# Altium project AudioDSP-1.0.PrjPcb
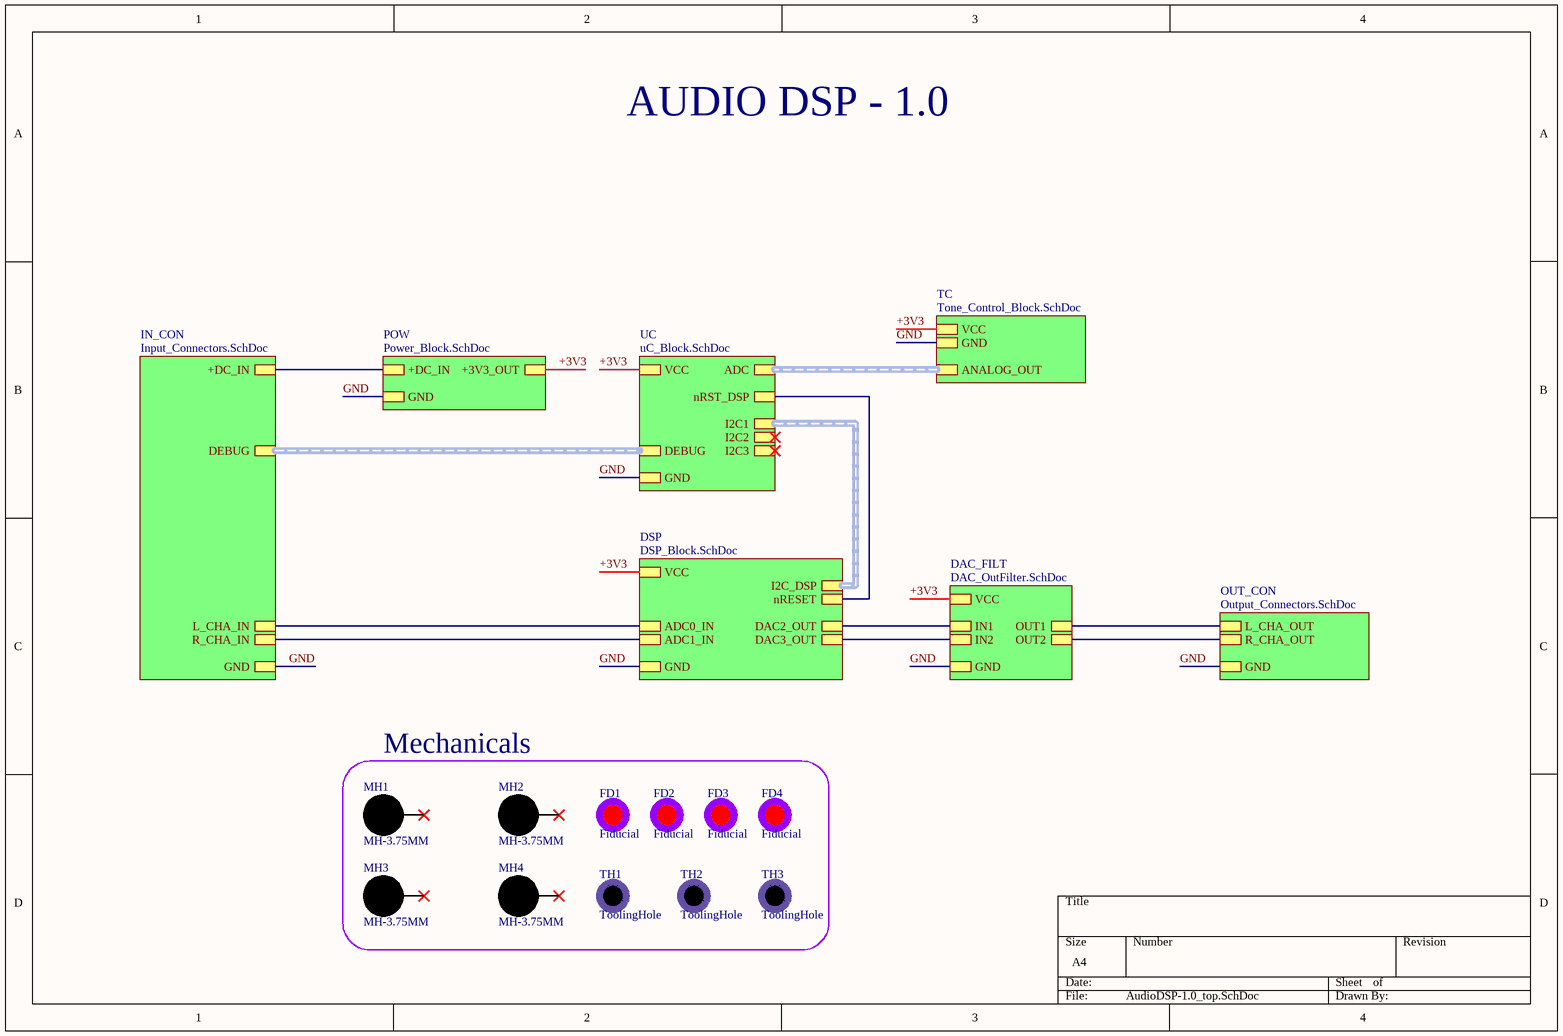
[diagram p0: AudioDSP-1.0_top.SchDoc]
8 sheets, 124 parts. Net scope: hierarchical (ports join the sheet entries above them; power ports are global).
Board file: AudioDSP-1.0.PcbDoc
Sheets:
  AudioDSP-1.0_top.SchDoc
    DSP = DSP_Block.SchDoc
    DAC_FILT = DAC_OutFilter.SchDoc
    IN_CON = Input_Connectors.SchDoc
    POW = Power_Block.SchDoc
    UC = uC_Block.SchDoc
    OUT_CON = Output_Connectors.SchDoc
    TC = Tone_Control_Block.SchDoc

## Sheet AudioDSP-1.0_top.SchDoc
size A4; SheetNumber: 1; SheetTotal: 8

### Parts
FD1  Fiducial  [Fiducial]  (no BOM)
FD2  Fiducial  [Fiducial]  (no BOM)
FD3  Fiducial  [Fiducial]  (no BOM)
FD4  Fiducial  [Fiducial]  (no BOM)
MH1  MH-3.75MM  [MH-3.75mm-NP]  (no BOM)
MH2  MH-3.75MM  [MH-3.75mm-NP]  (no BOM)
MH3  MH-3.75MM  [MH-3.75mm-NP]  (no BOM)
MH4  MH-3.75MM  [MH-3.75mm-NP]  (no BOM)
TH1  ToolingHole  [TOOLING-HOLE]  (no BOM)
TH2  ToolingHole  [TOOLING-HOLE]  (no BOM)
TH3  ToolingHole  [TOOLING-HOLE]  (no BOM)

### Blocks framed on the sheet
Mechanicals: FD1-FD4 MH1-MH4 TH1-TH3

### Sub-sheets
DAC_FILT = DAC_OutFilter.SchDoc: VCC, GND, IN1, IN2, OUT1, OUT2
DSP = DSP_Block.SchDoc: VCC, GND, I2C_DSP (harness I2C_BUS), nRESET, DAC2_OUT, DAC3_OUT, ADC0_IN, ADC1_IN
IN_CON = Input_Connectors.SchDoc: +DC_IN, GND, R_CHA_IN, L_CHA_IN, DEBUG (harness SERIAL_WIRE)
OUT_CON = Output_Connectors.SchDoc: R_CHA_OUT, L_CHA_OUT, GND
POW = Power_Block.SchDoc: +DC_IN, +3V3_OUT, GND
TC = Tone_Control_Block.SchDoc: VCC, GND, ANALOG_OUT (harness ADC_BUS)
UC = uC_Block.SchDoc: VCC, GND, DEBUG (harness SERIAL_WIRE), I2C1 (harness I2C_BUS), I2C2 (harness I2C_BUS), I2C3 (harness I2C_BUS), ADC (harness ADC_BUS), nRST_DSP

### Nets
+3V3: sheet DSP/VCC, sheet DAC_FILT/VCC, sheet POW/+3V3_OUT, sheet UC/VCC, sheet TC/VCC
+DC_IN: sheet IN_CON/+DC_IN, sheet POW/+DC_IN
ADC0_IN: sheet DSP/ADC0_IN, sheet IN_CON/L_CHA_IN
ADC1_IN: sheet DSP/ADC1_IN, sheet IN_CON/R_CHA_IN
DAC2_OUT: sheet DSP/DAC2_OUT, sheet DAC_FILT/IN1
DAC3_OUT: sheet DSP/DAC3_OUT, sheet DAC_FILT/IN2
GND: sheet DSP/GND, sheet DAC_FILT/GND, sheet IN_CON/GND, sheet POW/GND, sheet UC/GND, sheet OUT_CON/GND, sheet TC/GND
nRESET: sheet DSP/nRESET, sheet UC/nRST_DSP
OUT1: sheet DAC_FILT/OUT1, sheet OUT_CON/L_CHA_OUT
OUT2: sheet DAC_FILT/OUT2, sheet OUT_CON/R_CHA_OUT

Not connected (* = marked no-connect by the designer): MH1 1*; MH2 1*; MH3 1*; MH4 1*

### Buses and harness runs
harness sheet DSP/I2C_DSP = sheet UC/I2C1
harness sheet IN_CON/DEBUG = sheet UC/DEBUG
harness sheet TC/ANALOG_OUT = sheet UC/ADC

### Notes on the sheet
- AUDIO DSP - 1.0

### Library data of the parts
FD1-FD4 = Fiducial: ClassName: Fiducials
MH1-MH4 = MH-3.75MM: ClassName: MountHole
TH1-TH3 = ToolingHole: ClassName: Tooling

## Sheet DSP_Block.SchDoc
size A3; SheetNumber: 4; SheetTotal: 8
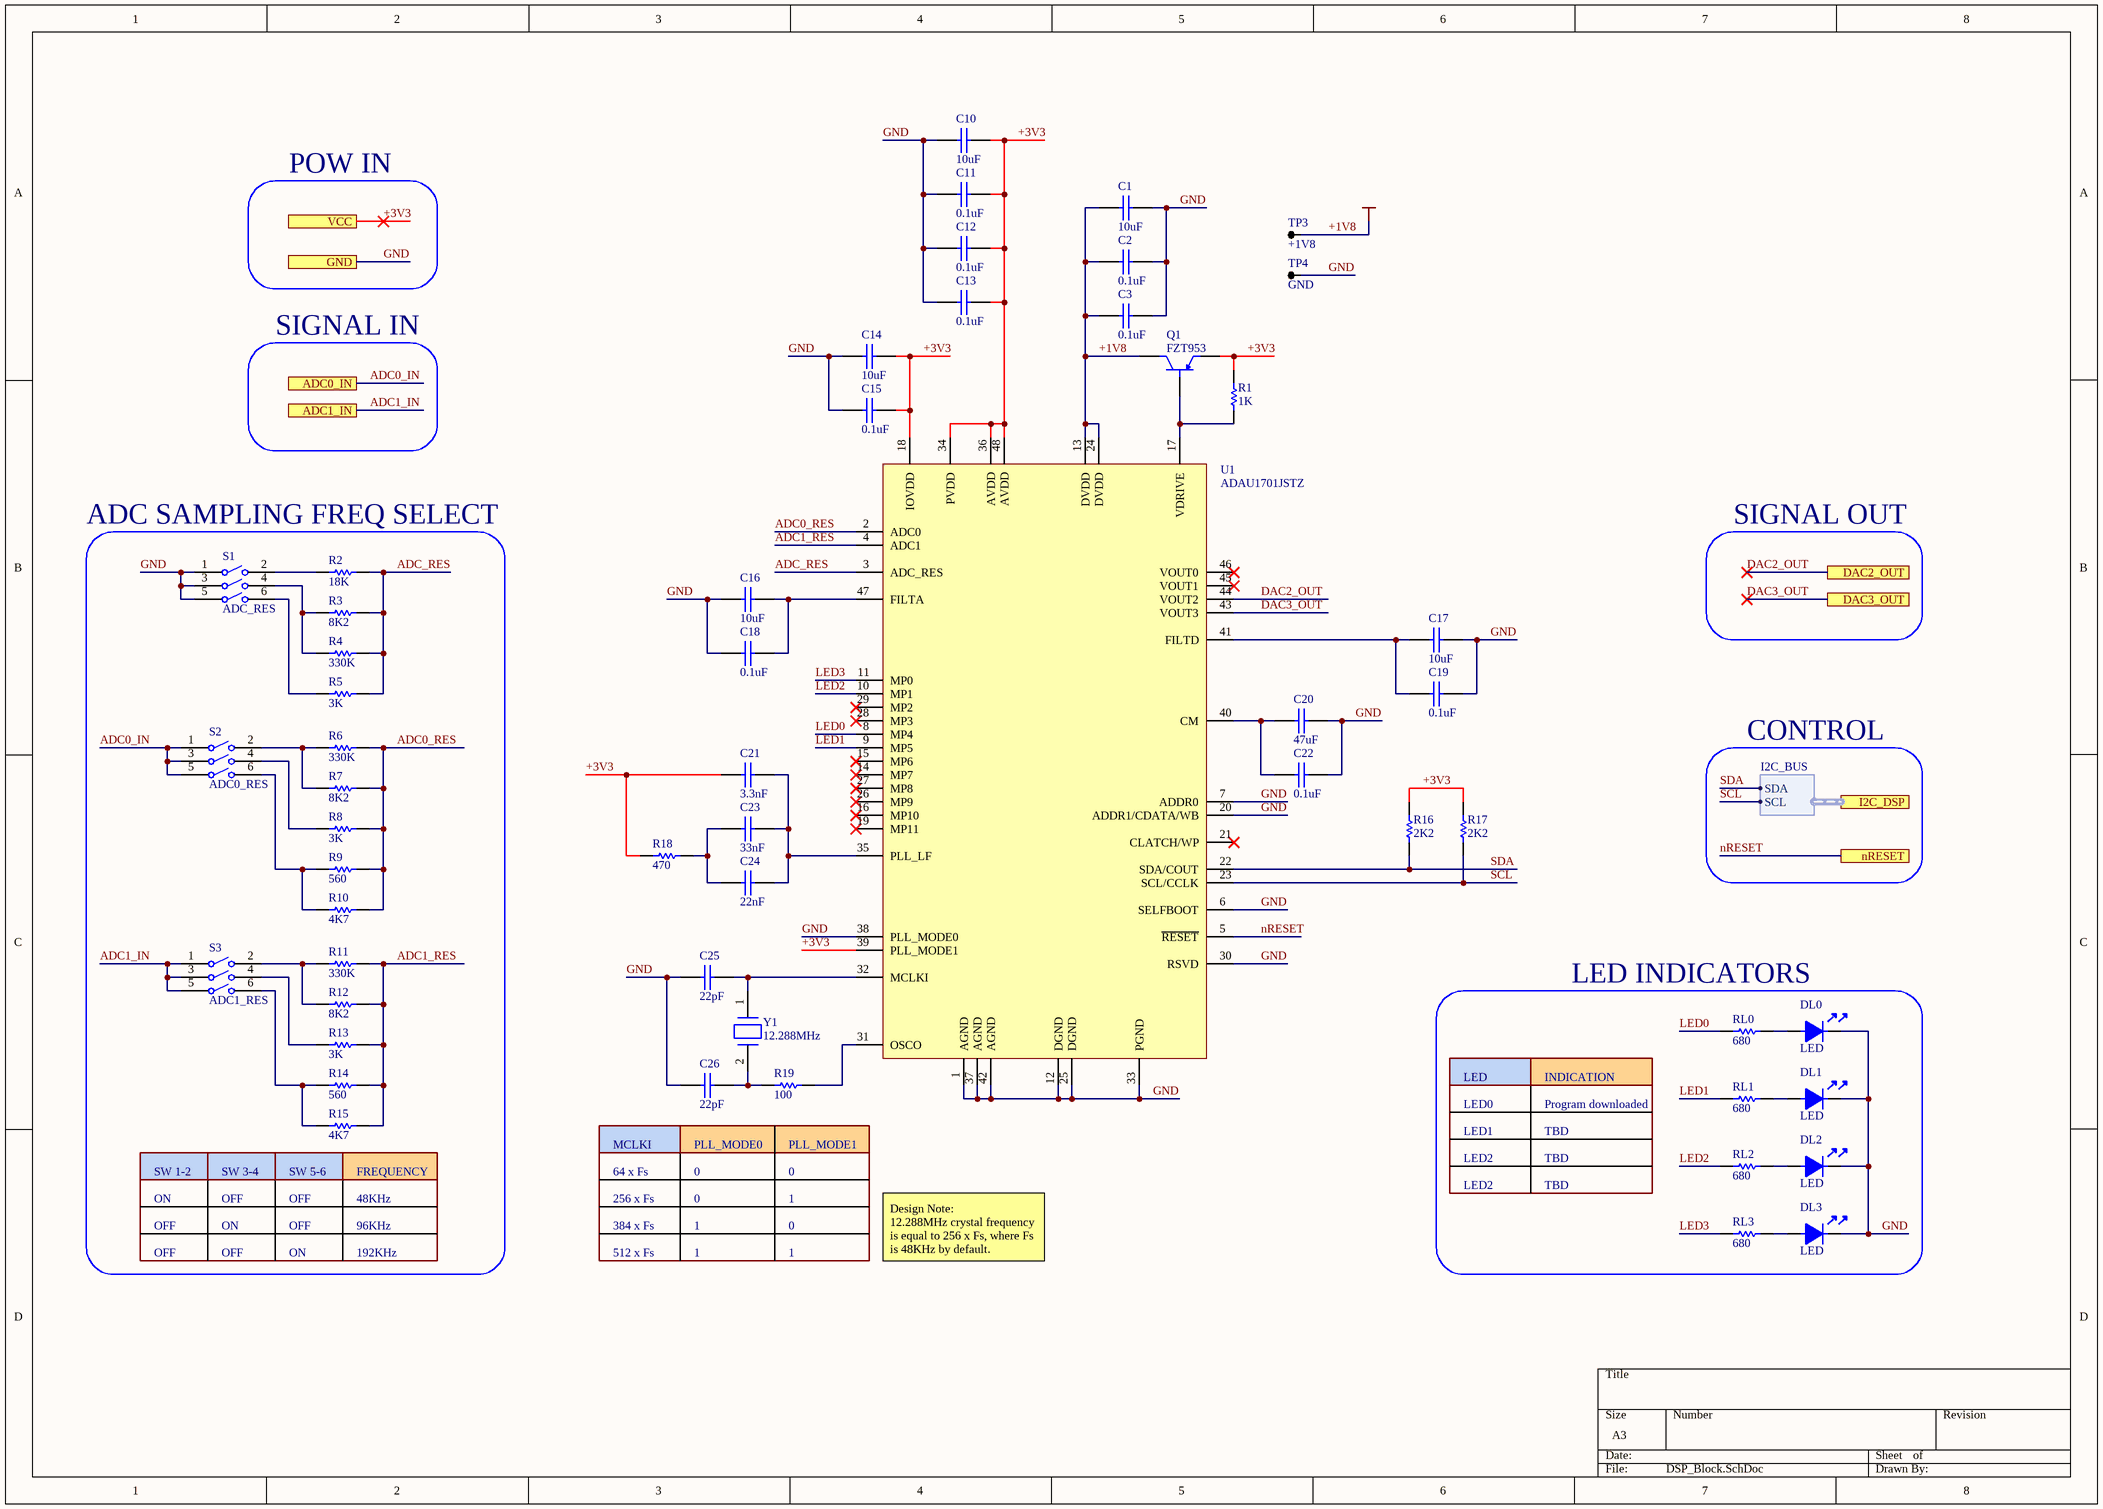
[diagram p1: DSP_Block.SchDoc]

### Parts
(Parts that share a designator on the sheet are numbered #1, #2 ... from top to bottom, then left to right.)
C1#1  10uF  [0805-CAP-TDK]
C2#1  0.1uF  [0402-CAP-TDK]
C3#1  0.1uF  [0402-CAP-TDK]
C10  10uF  [0805-CAP-TDK]
C11  0.1uF  [0402-CAP-TDK]
C12  0.1uF  [0402-CAP-TDK]
C13  0.1uF  [0402-CAP-TDK]
C14  10uF  [0805-CAP-TDK]
C15  0.1uF  [0402-CAP-TDK]
C16  10uF  [0805-CAP-TDK]
C17  10uF  [0805-CAP-TDK]
C18  0.1uF  [0402-CAP-TDK]
C19  0.1uF  [0402-CAP-TDK]
C20  47uF  [1206-CAP-TDK]
C21  3.3nF  [0402-CAP-TDK]
C22  0.1uF  [0402-CAP-TDK]
C23  33nF  [0603-CAP-TDK]
C24  22nF  [0603-CAP-TDK]
C25  22pF  [0402-CAP-TDK]
C26  22pF  [0402-CAP-TDK]
DL0  LED  [LED-3MM]
DL1  LED  [LED-3MM]
DL2  LED  [LED-3MM]
DL3  LED  [LED-3MM]
Q1  FZT953  [SOT223-DN]
R1#1  1K  [0402-RES-PANASONIC]
R2#1  18K  [0402-RES-PANASONIC]
R3  8K2  [0402-RES-PANASONIC]
R4  330K  [0402-RES-PANASONIC]
R5  3K  [0603-RES-PANASONIC]
R6  330K  [0402-RES-PANASONIC]
R7  8K2  [0402-RES-PANASONIC]
R8  3K  [0603-RES-PANASONIC]
R9  560  [0603-RES-PANASONIC]
R10  4K7  [0402-RES-PANASONIC]
R11  330K  [0402-RES-PANASONIC]
R12  8K2  [0402-RES-PANASONIC]
R13  3K  [0603-RES-PANASONIC]
R14  560  [0603-RES-PANASONIC]
R15  4K7  [0402-RES-PANASONIC]
R16  2K2  [0402-RES-PANASONIC]
R17  2K2  [0402-RES-PANASONIC]
R18  470  [0402-RES-PANASONIC]
R19  100  [0603-RES-PANASONIC]
RL0  680  [0402-RES-PANASONIC]
RL1  680  [0402-RES-PANASONIC]
RL2  680  [0402-RES-PANASONIC]
RL3  680  [0402-RES-PANASONIC]
S1#1  ADC_RES  [DIP-SW-3]
S2  ADC0_RES  [DIP-SW-3]
S3  ADC1_RES  [DIP-SW-3]
TP3  +1V8  [534-5280]
TP4  GND  [534-5280]
U1#1  ADAU1701JSTZ  [LQFP-48 - ST-48]
Y1  12.288MHz  [SMD5032]

### Blocks framed on the sheet
ADC SAMPLING FREQ SELECT: R2#1 R3-R15 S1#1 S2 S3
LED INDICATORS: DL0-DL3 RL0-RL3

### Ports
ADC0_IN, ADC1_IN, DAC2_OUT, DAC3_OUT, GND, I2C_DSP (harness I2C_BUS), nRESET, VCC

### Harnesses
I2C_BUS: SDA, SCL

### Nets
+1V8: C1#1.1 C2#1.1 C3#1.1 Q1.C TP3.1 U1#1.13(DVDD) U1#1.24(DVDD)
+3V3: C10.2 C11.2 C12.2 C13.2 C14.2 C15.2 C21.1 Q1.E R1#1.2 R16.2 R17.2 R18.2 U1#1.18(IOVDD) U1#1.34(PVDD) U1#1.36(AVDD) U1#1.39(PLL_MODE1) U1#1.48(AVDD) ; port VCC
ADC0_IN: S2.1 S2.3 S2.5 ; port ADC0_IN
ADC0_RES: R6.2 R7.2 R8.2 R9.2 R10.2 U1#1.2(ADC0)  [project net ADC0_RES_4]
ADC1_IN: S3.1 S3.3 S3.5 ; port ADC1_IN
ADC1_RES: R11.2 R12.2 R13.2 R14.2 R15.2 U1#1.4(ADC1)  [project net ADC1_RES_4]
ADC_RES: R2#1.2 R3.2 R4.2 R5.2 U1#1.3(ADC_RES)  [project net ADC_RES_4]
DAC2_OUT: U1#1.44(VOUT2) ; port DAC2_OUT
DAC3_OUT: U1#1.43(VOUT3) ; port DAC3_OUT
GND: C1#1.2 C2#1.2 C3#1.2 C10.1 C11.1 C12.1 C13.1 C14.1 C15.1 C16.1 C17.2 C18.1 C19.2 C20.2 C22.2 C25.1 C26.1 DL0.2 DL1.2 DL2.2 DL3.2 S1#1.1 S1#1.3 S1#1.5 TP4.1 U1#1.1(AGND) U1#1.6(SELFBOOT) U1#1.7(ADDR0) U1#1.12(DGND) U1#1.20(ADDR1/CDATA/WB) U1#1.25(DGND) U1#1.30(RSVD) U1#1.33(PGND) U1#1.37(AGND) U1#1.38(PLL_MODE0) U1#1.42(AGND) ; port GND
LED0: RL0.2 U1#1.8(MP4)  [project net LED0_4]
LED1: RL1.2 U1#1.9(MP5)  [project net LED1_4]
LED2: RL2.2 U1#1.10(MP1)  [project net LED2_4]
LED3: RL3.2 U1#1.11(MP0)  [project net LED3_4]
nRESET: U1#1.5(~{RESET}) ; port nRESET
SCL: R17.1 U1#1.23(SCL/CCLK) ; port I2C_DSP.SCL  [project net I2C1_SCL]
SDA: R16.1 U1#1.22(SDA/COUT) ; port I2C_DSP.SDA  [project net I2C1_SDA]
NetC16_2: C16.2 C18.2 U1#1.47(FILTA)
NetC17_1: C17.1 C19.1 U1#1.41(FILTD)
NetC20_1: C20.1 C22.1 U1#1.40(CM)
NetC21_2: C21.2 C23.2 C24.2 U1#1.35(PLL_LF)
NetC23_1: C23.1 C24.1 R18.1
NetC25_2: C25.2 U1#1.32(MCLKI) Y1.1
NetC26_2: C26.2 R19.2 Y1.2
NetDL0_1: DL0.1 RL0.1
NetDL1_1: DL1.1 RL1.1
NetDL2_1: DL2.1 RL2.1
NetDL3_1: DL3.1 RL3.1
NetQ1_B: Q1.B R1#1.1 U1#1.17(VDRIVE)
NetR2#1_1: R2#1.1 S1#1.2
NetR3_1: R3.1 R4.1 S1#1.4
NetR5_1: R5.1 S1#1.6
NetR6_1: R6.1 R7.1 S2.2
NetR8_1: R8.1 S2.4
NetR9_1: R9.1 R10.1 S2.6
NetR11_1: R11.1 R12.1 S3.2
NetR13_1: R13.1 S3.4
NetR14_1: R14.1 R15.1 S3.6
NetR19_1: R19.1 U1#1.31(OSCO)

Not connected (* = marked no-connect by the designer): U1#1 14(MP7)* 15(MP6)* 16(MP10)* 19(MP11)* 21(CLATCH/WP)* 26(MP9)* 27(MP8)* 28(MP3)* 29(MP2)* 45(VOUT1)* 46(VOUT0)*

### Notes on the sheet
- POW IN
- SIGNAL IN
- SIGNAL OUT
- CONTROL
- LED0
- LED
- Program downloaded
- INDICATION
- SW 1-2
- SW 3-4
- (near R15) SW 5-6
- (near R15) FREQUENCY
- 64 x Fs
- MCLKI
- 0
- PLL_MODE0
- PLL_MODE1
- LED1
- LED2
- TBD
- ON
- OFF
- 48KHz
- 96KHz
- 192KHz
- 256 x Fs
- 384 x Fs
- 512 x Fs
- 1
- Design Note:
  12.288MHz crystal frequency is equal to 256 x Fs, where Fs is 48KHz by default.

### Library data of the parts
C1#1 C2#1 C3#1 C10-C26 = CAP-SMD
  C1#1 C10 C14 C16 C17: JLCPart: C15850
  C2#1 C3#1 C11-C13 C15 C18 C19 C22: JLCPart: C307331
  C20: JLCPart: C96123
  C21: JLCPart: C26404
  C23: JLCPart: C21117
  C24: JLCPart: C21122
  C25 C26: JLCPart: C1555
R1#1 R2#1 R3-R19 RL0-RL3 = RES-SMD
  R1#1: JLCPart: C11702
  R2#1: JLCPart: C25762
  R3 R7 R12: JLCPart: C25924
  R4 R6 R11: JLCPart: C25778
  R5 R8 R13: JLCPart: C4211
  R9 R14: JLCPart: C23204
  R10 R15: JLCPart: C25900
  R16 R17: JLCPart: C25879
  R18: JLCPart: C25117
  R19: JLCPart: C22775
  RL0-RL3: JLCPart: C25130
S1#1 S2 S3 = DIP-SW-3
TP3 TP4 = TP-CLAW
U1#1 = ADAU1701JSTZ: SigmaDSP 28-/56-Bit Audio Processor with Two ADCs and Four DACs; JLCPart: C389590
Y1 = 12.288MHz Crystal: JLCPart: C251589
Q1 = FZT953: JLCPart: C499616

## Sheet DAC_OutFilter.SchDoc
size A4; SheetNumber: 7; SheetTotal: 8
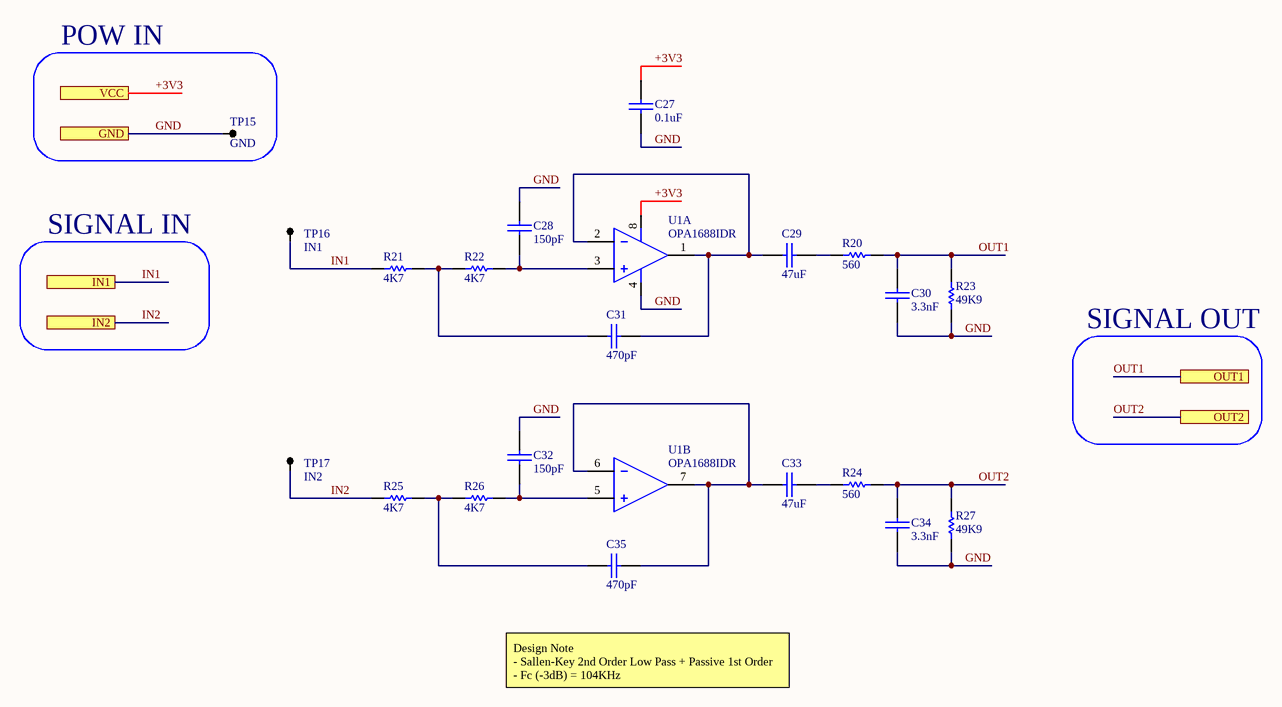
[diagram p2: DAC_OutFilter.SchDoc]

### Parts
(Parts that share a designator on the sheet are numbered #1, #2 ... from top to bottom, then left to right.)
C27  0.1uF  [0402-CAP-TDK]
C28  150pF  [0402-CAP-TDK]
C29  47uF  [1206-CAP-TDK]
C30  3.3nF  [0402-CAP-TDK]
C31  470pF  [0402-CAP-TDK]
C32  150pF  [0402-CAP-TDK]
C33  47uF  [1206-CAP-TDK]
C34  3.3nF  [0402-CAP-TDK]
C35  470pF  [0402-CAP-TDK]
R20  560  [0603-RES-PANASONIC]
R21  4K7  [0402-RES-PANASONIC]
R22  4K7  [0402-RES-PANASONIC]
R23  49K9  [0402-RES-PANASONIC]
R24  560  [0603-RES-PANASONIC]
R25  4K7  [0402-RES-PANASONIC]
R26  4K7  [0402-RES-PANASONIC]
R27  49K9  [0402-RES-PANASONIC]
TP15  GND  [534-5280]
TP16  IN1  [534-5280]
TP17  IN2  [534-5280]
U1#2  OPA1688IDR  [TI-SOIC-8]  (parts A,B of 2)

### Blocks framed on the sheet
POW IN: TP15

### Ports
GND, IN1, IN2, OUT1, OUT2, VCC

### Nets
+3V3: C27.2 U1#2.8(VDD) ; port VCC
GND: C27.1 C28.1 C30.2 C32.1 C34.2 R23.1 R27.1 TP15.1 U1#2.4(GND) ; port GND
IN1: R21.1 TP16.1 ; port IN1  [project net DAC2_OUT]
IN2: R25.1 TP17.1 ; port IN2  [project net DAC3_OUT]
OUT1: C30.1 R20.2 R23.2 ; port OUT1
OUT2: C34.1 R24.2 R27.2 ; port OUT2
NetC28_2: C28.2 R22.2 U1#2.3(1IN+)
NetC29_1: C29.1 R20.1
NetC29_2: C29.2 C31.1 U1#2.1(1OUT) U1#2.2(1IN-)
NetC31_2: C31.2 R21.2 R22.1
NetC32_2: C32.2 R26.2 U1#2.5(2IN+)
NetC33_1: C33.1 R24.1
NetC33_2: C33.2 C35.1 U1#2.6(2IN-) U1#2.7(2OUT)
NetC35_2: C35.2 R25.2 R26.1

### Notes on the sheet
- SIGNAL IN
- SIGNAL OUT
- Design Note
  - Sallen-Key 2nd Order Low Pass + Passive 1st Order
  - Fc (-3dB) = 104KHz

### Library data of the parts
C27-C35 = CAP-SMD
  C27: JLCPart: C307331
R20-R27 = RES-SMD
TP15-TP17 = TP-CLAW
U1#2 = OPA1688IDR: Rail-To-Rail Amplifier 2 Circuit - 8-SOIC

## Sheet Input_Connectors.SchDoc
size A4; SheetNumber: 5; SheetTotal: 8
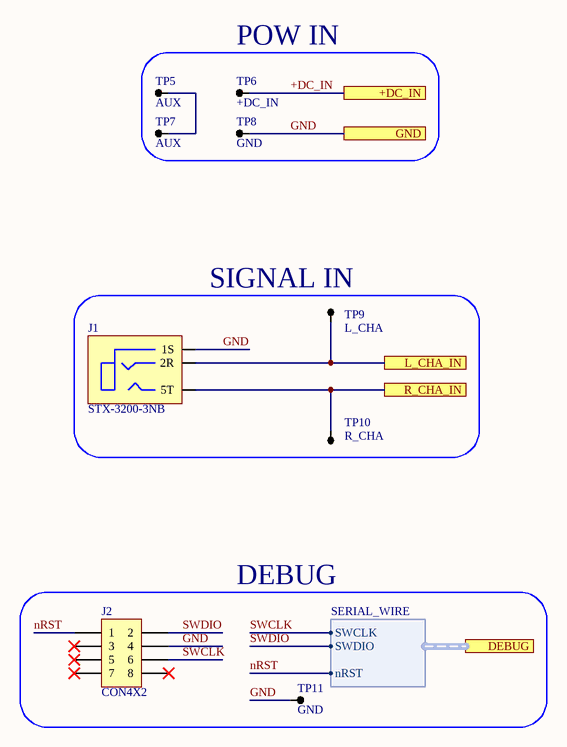
[diagram p3: Input_Connectors.SchDoc]

### Parts
J1  STX-3200-3NB  [JACK-3.5-3POS]
J2  CON4X2  [SIP4X2]
TP5  AUX  [534-5280]
TP6  +DC_IN  [534-5280]
TP7  AUX  [534-5280]
TP8  GND  [534-5280]
TP9  L_CHA  [534-5280]
TP10  R_CHA  [534-5280]
TP11  GND  [534-5280]

### Blocks framed on the sheet
POW IN: TP5-TP8
SIGNAL IN: J1 TP9 TP10
DEBUG: J2 TP11

### Ports
+DC_IN, DEBUG (harness SERIAL_WIRE), GND, L_CHA_IN, R_CHA_IN

### Harnesses
SERIAL_WIRE: SWCLK, SWDIO, nRST

### Nets
+DC_IN: TP6.1 ; port +DC_IN
ADC0_IN: J1.2R TP9.1 ; port L_CHA_IN
ADC1_IN: J1.5T TP10.1 ; port R_CHA_IN
GND: J1.1S J2.4 TP8.1 TP11.1 ; port GND
nRST: J2.1 ; port DEBUG.nRST
SWCLK: J2.6 ; port DEBUG.SWCLK
SWDIO: J2.2 ; port DEBUG.SWDIO
NetTP5_1: TP5.1 TP7.1

Not connected (* = marked no-connect by the designer): J2 3* 5* 7* 8*

### Library data of the parts
TP5-TP11 = TP-CLAW

## Sheet Power_Block.SchDoc
size A4; SheetNumber: 2; SheetTotal: 8
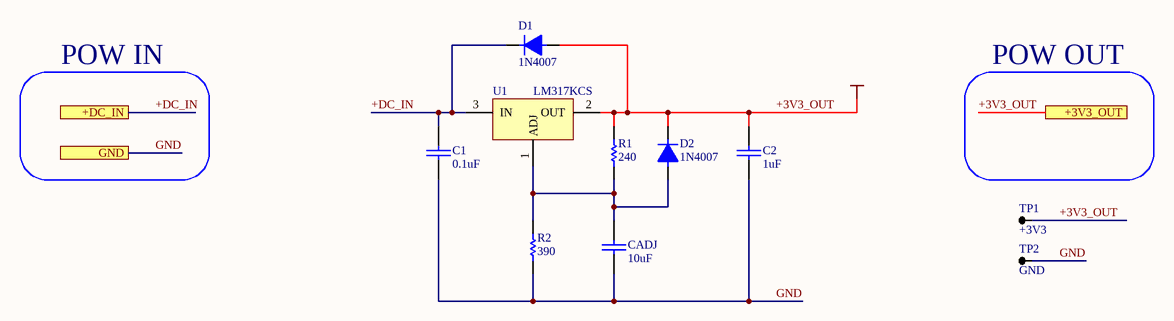
[diagram p4: Power_Block.SchDoc]

### Parts
(Parts that share a designator on the sheet are numbered #1, #2 ... from top to bottom, then left to right.)
C1#2  0.1uF  [0402-CAP-TDK]
C2#2  1uF  [0805-CAP-TDK]
CADJ  10uF  [0805-CAP-TDK]
D1  1N4007  [DO41]
D2  1N4007  [DO41]
R1#2  240  [0805-RES-PANASONIC]
R2#2  390  [0805-RES-PANASONIC]
TP1  +3V3  [534-5280]
TP2  GND  [534-5280]
U1#3  LM317KCS  [TO-220 - KCS0003B]

### Ports
+3V3_OUT, +DC_IN, GND

### Nets
+3V3: C2#2.2 D1.1 D2.2 R1#2.2 TP1.1 U1#3.2(OUT) ; port +3V3_OUT  [also labelled +3V3_OUT]
+DC_IN: C1#2.2 D1.2 U1#3.3(IN) ; port +DC_IN
GND: C1#2.1 C2#2.1 CADJ.1 R2#2.1 TP2.1 ; port GND
NetCADJ_2: CADJ.2 D2.1 R1#2.1 R2#2.2 U1#3.1(ADJ)

### Notes on the sheet
- POW IN
- POW OUT

### Library data of the parts
C1#2 C2#2 CADJ = CAP-SMD
  C1#2: JLCPart: C307331
  C2#2: JLCPart: C28323
  CADJ: JLCPart: C15850
D1 D2 = DIODE RECTIFIER
R1#2 R2#2 = RES-SMD
  R1#2: JLCPart: C17572
  R2#2: JLCPart: C17655
TP1 TP2 = TP-CLAW

## Sheet uC_Block.SchDoc
size A4; SheetNumber: 3; SheetTotal: 8
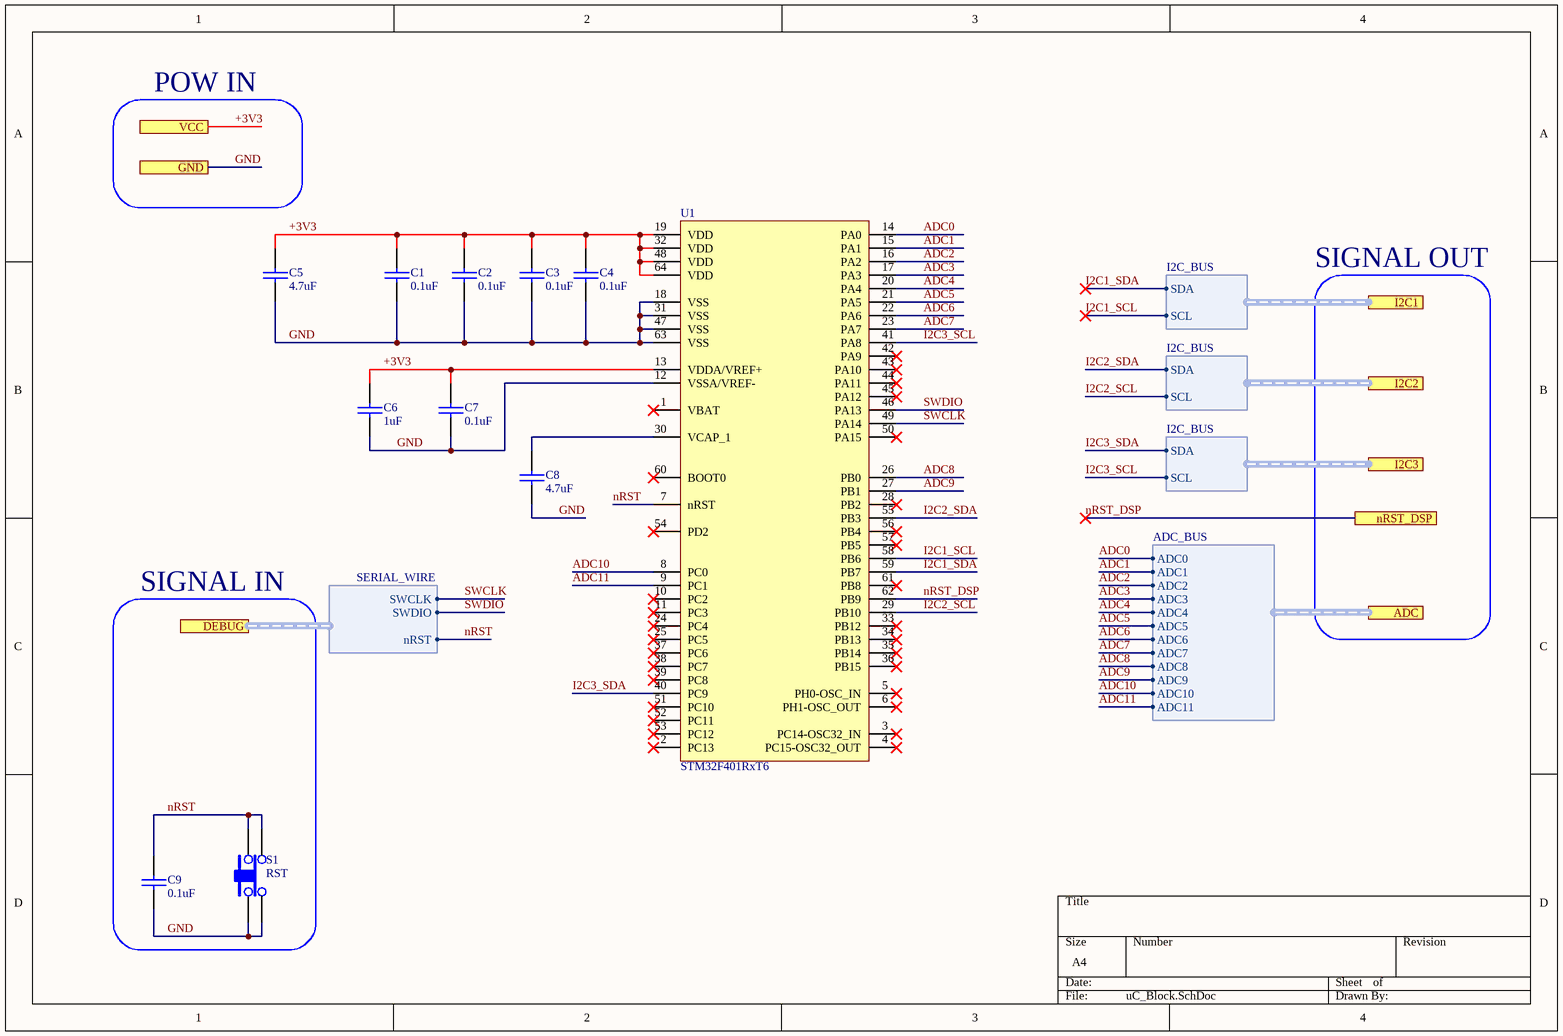
[diagram p5: uC_Block.SchDoc]

### Parts
(Parts that share a designator on the sheet are numbered #1, #2 ... from top to bottom, then left to right.)
C1#3  0.1uF  [0402-CAP-TDK]
C2#3  0.1uF  [0402-CAP-TDK]
C3#2  0.1uF  [0402-CAP-TDK]
C4  0.1uF  [0402-CAP-TDK]
C5  4.7uF  [0805-CAP-TDK]
C6  1uF  [0805-CAP-TDK]
C7  0.1uF  [0402-CAP-TDK]
C8  4.7uF  [0805-CAP-TDK]
C9  0.1uF  [0402-CAP-TDK]
S1#2  RST  [TACT-SWITCH]
U1#4  STM32F401RxT6  [LQFP-64]

### Blocks framed on the sheet
SIGNAL IN: C9 S1#2

### Ports
ADC (harness ADC_BUS), DEBUG (harness SERIAL_WIRE), GND, I2C1 (harness I2C_BUS), I2C2 (harness I2C_BUS), I2C3 (harness I2C_BUS), nRST_DSP, VCC

### Harnesses
SERIAL_WIRE: SWCLK, SWDIO, nRST
I2C_BUS: SDA, SCL
ADC_BUS: ADC0, ADC1, ADC2, ADC3, ADC4, ADC5, ADC6, ADC7, ADC8, ADC9, ADC10, ADC11

### Nets
+3V3: C1#3.2 C2#3.2 C3#2.2 C4.2 C5.2 C6.2 C7.2 U1#4.13(VDDA/VREF+) U1#4.19(VDD) U1#4.32(VDD) U1#4.48(VDD) U1#4.64(VDD) ; port VCC
ADC0: U1#4.14(PA0) ; port ADC.ADC0
ADC1: U1#4.15(PA1) ; port ADC.ADC1
ADC2: U1#4.16(PA2) ; port ADC.ADC2
ADC3: U1#4.17(PA3) ; port ADC.ADC3
ADC4: U1#4.20(PA4) ; port ADC.ADC4
ADC5: U1#4.21(PA5) ; port ADC.ADC5
ADC6: U1#4.22(PA6) ; port ADC.ADC6
ADC7: U1#4.23(PA7) ; port ADC.ADC7
ADC8: U1#4.26(PB0) ; port ADC.ADC8
ADC9: U1#4.27(PB1) ; port ADC.ADC9
ADC10: U1#4.8(PC0) ; port ADC.ADC10
ADC11: U1#4.9(PC1) ; port ADC.ADC11
GND: C1#3.1 C2#3.1 C3#2.1 C4.1 C5.1 C6.1 C7.1 C8.1 C9.1 S1#2.1 S1#2.2 U1#4.12(VSSA/VREF-) U1#4.18(VSS) U1#4.31(VSS) U1#4.47(VSS) U1#4.63(VSS) ; port GND
I2C1_SCL: U1#4.58(PB6) ; port I2C1.SCL
I2C1_SDA: U1#4.59(PB7) ; port I2C1.SDA
I2C2_SCL: U1#4.29(PB10) ; port I2C2.SCL
I2C2_SDA: U1#4.55(PB3) ; port I2C2.SDA
I2C3_SCL: U1#4.41(PA8) ; port I2C3.SCL
I2C3_SDA: U1#4.40(PC9) ; port I2C3.SDA
nRST: C9.2 S1#2.3 S1#2.4 U1#4.7(nRST) ; port DEBUG.nRST
nRST_DSP: U1#4.62(PB9) ; port nRST_DSP  [project net nRESET]
SWCLK: U1#4.49(PA14) ; port DEBUG.SWCLK
SWDIO: U1#4.46(PA13) ; port DEBUG.SWDIO
NetC8_2: C8.2 U1#4.30(VCAP_1)

Not connected (* = marked no-connect by the designer): U1#4 1(VBAT)* 2(PC13)* 3(PC14-OSC32_IN)* 4(PC15-OSC32_OUT)* 5(PH0-OSC_IN)* 6(PH1-OSC_OUT)* 10(PC2)* 11(PC3)* 24(PC4)* 25(PC5)* 28(PB2)* 33(PB12)* 34(PB13)* 35(PB14)* 36(PB15)* 37(PC6)* 38(PC7)* 39(PC8)* 42(PA9)* 43(PA10)* 44(PA11)* 45(PA12)* 50(PA15)* 51(PC10)* 52(PC11)* 53(PC12)* 54(PD2)* 56(PB4)* 57(PB5)* 60(BOOT0)* 61(PB8)*

### Notes on the sheet
- POW IN
- SIGNAL OUT

### Library data of the parts
C1#3 C2#3 C3#2 C4-C9 = CAP-SMD
  C1#3 C2#3 C3#2 C4 C7 C9: JLCPart: C307331
  C5 C8: JLCPart: C1779
  C6: JLCPart: C28323
S1#2 = TACT-SWITCH
U1#4 = STM32F401RxT6: JLCPart: C74524

## Sheet Output_Connectors.SchDoc
size A4; SheetNumber: 6; SheetTotal: 7
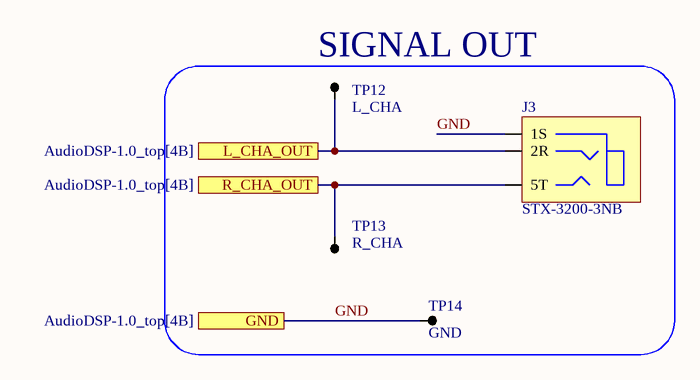
[diagram p6: Output_Connectors.SchDoc]

### Parts
J3  STX-3200-3NB  [JACK-3.5-3POS]
TP12  L_CHA  [534-5280]
TP13  R_CHA  [534-5280]
TP14  GND  [534-5280]

### Blocks framed on the sheet
SIGNAL OUT: J3 TP12-TP14

### Ports
GND (see AudioDSP-1.0_top[4B]), L_CHA_OUT (see AudioDSP-1.0_top[4B]), R_CHA_OUT (see AudioDSP-1.0_top[4B])

### Nets
GND: J3.1S TP14.1 ; port GND
OUT1: J3.2R TP12.1 ; port L_CHA_OUT
OUT2: J3.5T TP13.1 ; port R_CHA_OUT

### Library data of the parts
TP12-TP14 = TP-CLAW

## Sheet Tone_Control_Block.SchDoc
size A4; SheetNumber: 8; SheetTotal: 8
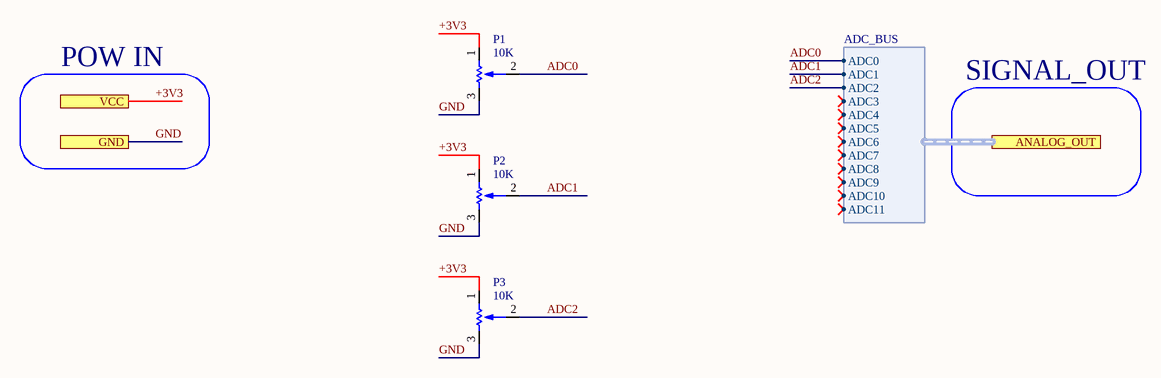
[diagram p7: Tone_Control_Block.SchDoc]

### Parts
P1  10K  [POT-THT]
P2  10K  [POT-THT]
P3  10K  [POT-THT]

### Ports
ANALOG_OUT (harness ADC_BUS), GND, VCC

### Harnesses
ADC_BUS: ADC0, ADC1, ADC2, ADC3, ADC4, ADC5, ADC6, ADC7, ADC8, ADC9, ADC10, ADC11

### Nets
+3V3: P1.1 P2.1 P3.1 ; port VCC
ADC0: P1.2 ; port ANALOG_OUT.ADC0
ADC1: P2.2 ; port ANALOG_OUT.ADC1
ADC2: P3.2 ; port ANALOG_OUT.ADC2
GND: P1.3 P2.3 P3.3 ; port GND

### Notes on the sheet
- POW IN
- SIGNAL_OUT

### Library data of the parts
P1-P3 = POT-THT

## Nets that join several sheets
+3V3: DSP_Block (17 pins), DAC_OutFilter (C27.2 U1#2.8), Power_Block (6 pins), uC_Block (12 pins), Tone_Control_Block (P1.1 P2.1 P3.1)
+DC_IN: Input_Connectors (TP6.1), Power_Block (C1#2.2 D1.2 U1#3.3)
ADC0: uC_Block (U1#4.14), Tone_Control_Block (P1.2)
ADC0_IN: DSP_Block (S2.1 S2.3 S2.5), Input_Connectors (J1.2R TP9.1)
ADC1: uC_Block (U1#4.15), Tone_Control_Block (P2.2)
ADC1_IN: DSP_Block (S3.1 S3.3 S3.5), Input_Connectors (J1.5T TP10.1)
ADC2: uC_Block (U1#4.16), Tone_Control_Block (P3.2)
DAC2_OUT: DSP_Block (U1#1.44), DAC_OutFilter (R21.1 TP16.1)
DAC3_OUT: DSP_Block (U1#1.43), DAC_OutFilter (R25.1 TP17.1)
GND: DSP_Block (36 pins), DAC_OutFilter (9 pins), Input_Connectors (J1.1S J2.4 TP8.1 TP11.1), Power_Block (5 pins), uC_Block (16 pins), Output_Connectors (J3.1S TP14.1), Tone_Control_Block (P1.3 P2.3 P3.3)
I2C1_SCL: DSP_Block (R17.1 U1#1.23), uC_Block (U1#4.58)
I2C1_SDA: DSP_Block (R16.1 U1#1.22), uC_Block (U1#4.59)
nRESET: DSP_Block (U1#1.5), uC_Block (U1#4.62)
nRST: Input_Connectors (J2.1), uC_Block (C9.2 S1#2.3 S1#2.4 U1#4.7)
OUT1: DAC_OutFilter (C30.1 R20.2 R23.2), Output_Connectors (J3.2R TP12.1)
OUT2: DAC_OutFilter (C34.1 R24.2 R27.2), Output_Connectors (J3.5T TP13.1)
SWCLK: Input_Connectors (J2.6), uC_Block (U1#4.49)
SWDIO: Input_Connectors (J2.2), uC_Block (U1#4.46)

## Assembly variants
For Assembly: not fitted D1_POW D2_POW DL0_DSP DL1_DSP DL2_DSP DL3_DSP DP1_POW J1 J2 J3 P1_TC P2_TC P3_TC Q1_DSP S1_DSP S1_UC S2_DSP S3_DSP TP1_POW TP2_POW TP3 TP4 TP5 TP6 TP7 TP8 TP9 TP10 TP11 TP12 TP13 TP14 TP15 TP16 TP17 U1_DAC_FILT U1_POW